# Altium project sion.PrjPcb
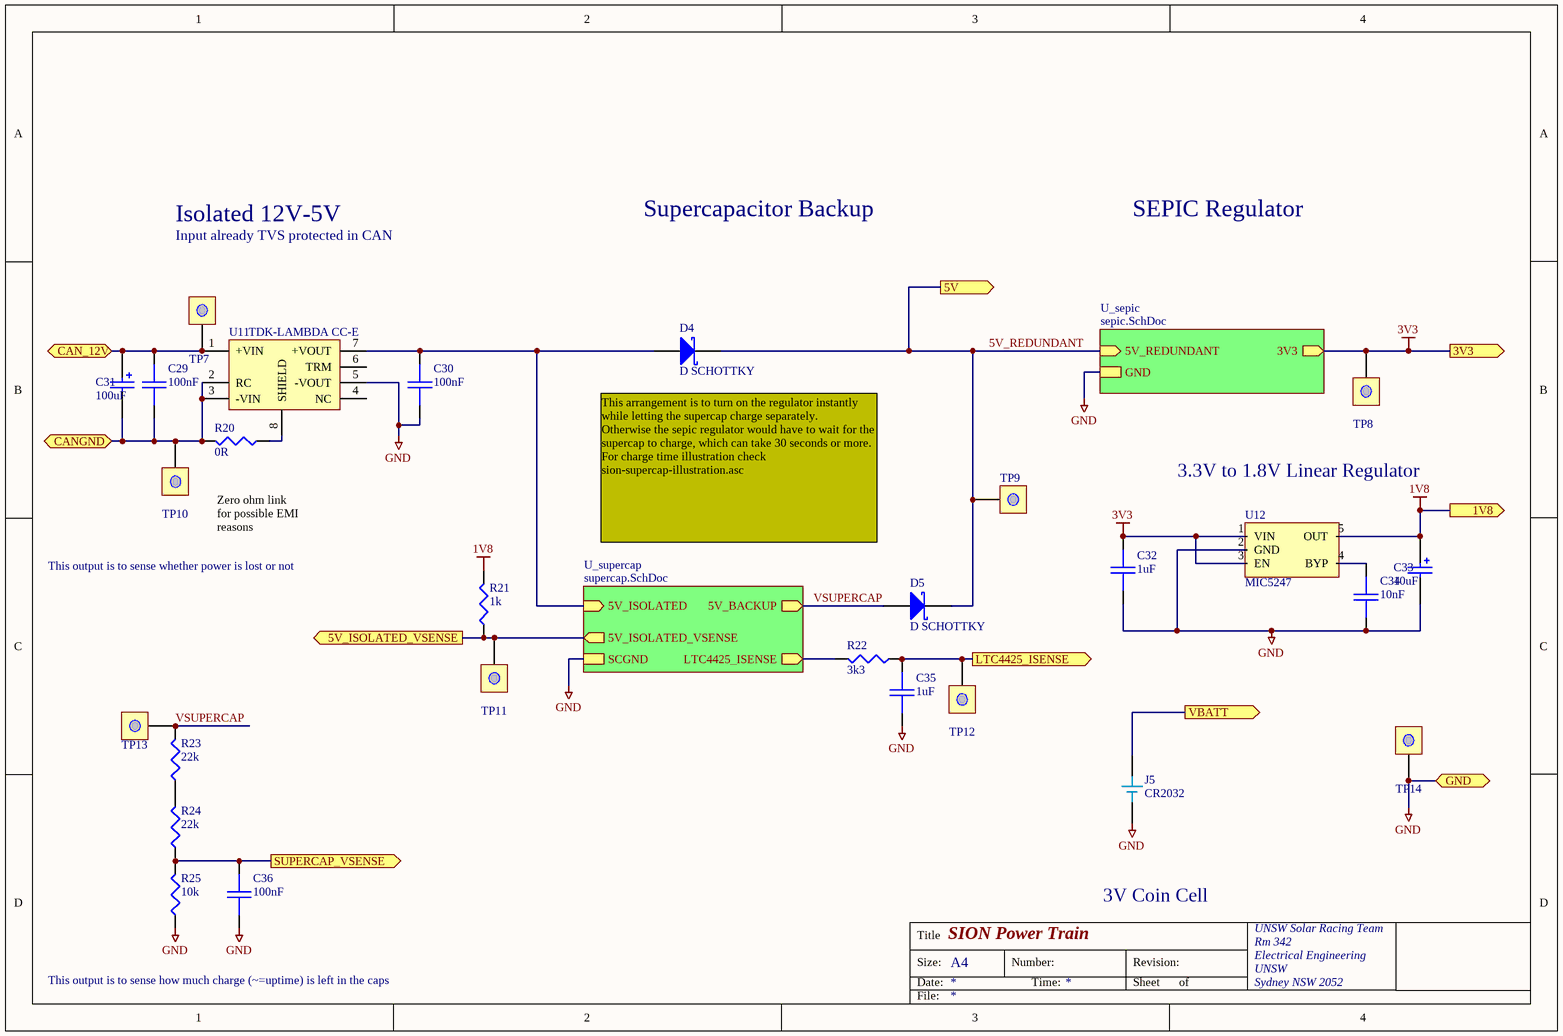
[diagram p0: powertrain.SchDoc]
4 sheets, 111 parts. Net scope: hierarchical (ports join the sheet entries above them; power ports are global).
Board file: sion_pcb_v2.PcbDoc
Sheets:
  powertrain.SchDoc
    U_supercap = supercap.SchDoc
    U_sepic = sepic.SchDoc
  LPC1768.SchDoc

## Sheet powertrain.SchDoc: SION Power Train
size A4; Organization: UNSW Solar Racing Team; Address3: UNSW; Address4: Sydney NSW 2052; Address2: Electrical Engineering; Address1: Rm 342

### Parts
C29  100nF  [0603]
C30  100nF  [0603]
C31  100uF  [MCCT-CASEA]
C32  1uF  [0805]
C33  10uF  [MCCT-CASEA]
C34  10nF  [0603]
C35  1uF  [0805]
C36  100nF  [0603]
D4  D SCHOTTKY  [DIODE-D1.5mm]
D5  D SCHOTTKY  [DIODE-D1.5mm]
J5  CR2032  [CR2032_VERTICAL]
R20  0R  [1206]
R21  1k  [0603]
R22  3k3  [0603]
R23  22k  [0805]
R24  22k  [0805]
R25  10k  [0805]
TP7  CAN12V  [TESTPOINT]  (value not drawn)
TP8  3V3  [TESTPOINT]  (value not drawn)
TP9  5V  [TESTPOINT]  (value not drawn)
TP10  CANGND  [TESTPOINT]  (value not drawn)
TP11  VSENSE  [TESTPOINT]  (value not drawn)
TP12  ISENSE  [TESTPOINT]  (value not drawn)
TP13  VCAP  [TESTPOINT]  (value not drawn)
TP14  GND  [TESTPOINT]  (value not drawn)
U11  TDK-LAMBDA CC-E  [CC10-F-E]
U12  MIC5247  [SOT23-5]

### Sub-sheets
U_sepic = sepic.SchDoc: 3V3 (out), 5V_REDUNDANT (in), GND
U_supercap = supercap.SchDoc: LTC4425_ISENSE (out), 5V_ISOLATED (in), 5V_BACKUP (out), SCGND, 5V_ISOLATED_VSENSE (out)

### Ports
1V8 (out), 3V3 (out), 5V (out), 5V_ISOLATED_VSENSE (out), CAN_12V, CANGND, GND, LTC4425_ISENSE (out), SUPERCAP_VSENSE (out), VBATT (out)

### Nets
1V8: C33.1 R21.2 U12.5(OUT) ; port 1V8
3V3: C32.1 TP8.0(TP) U12.1(VIN) U12.3(EN) ; port 3V3, sheet U_sepic/3V3  [project net VDDA]
GND: C30.2 C32.2 C33.2 C34.2 C35.2 C36.2 J5.2 R25.1 TP14.0(TP) U11.5(-VOUT) U12.2(GND) ; port GND, sheet U_supercap/SCGND, sheet U_sepic/GND  [project net VREFN]
5V_ISOLATED: C30.1 D4.A U11.7(+VOUT) ; sheet U_supercap/5V_ISOLATED
5V_REDUNDANT: D4.K D5.K TP9.0(TP) ; port 5V, sheet U_sepic/5V_REDUNDANT
~{PFO}: R21.1 TP11.0(TP) ; port 5V_ISOLATED_VSENSE, sheet U_supercap/5V_ISOLATED_VSENSE
PROG: R22.2 ; sheet U_supercap/LTC4425_ISENSE
VSUPERCAP: D5.A R23.2 TP13.0(TP) ; sheet U_supercap/5V_BACKUP
NetC29_1: C29.1 C31.1 TP7.0(TP) U11.1(+VIN) ; port CAN_12V
NetC29_2: C29.2 C31.2 R20.2 TP10.0(TP) U11.2(RC) U11.3(-VIN) ; port CANGND
NetC34_1: C34.1 U12.4(BYP)
NetC35_1: C35.1 R22.1 TP12.0(TP) ; port LTC4425_ISENSE
NetC36_1: C36.1 R24.1 R25.2 ; port SUPERCAP_VSENSE
NetJ5_1: J5.1(3V) ; port VBATT
NetR20_1: R20.1 U11.8(SHIELD)
NetR23_1: R23.1 R24.2

Not connected (* = marked no-connect by the designer): U11 4(NC) 6(TRM)

### Notes on the sheet
- Isolated 12V-5V
- Input already TVS protected in CAN
- Supercapacitor Backup
- SEPIC Regulator
- 3.3V to 1.8V Linear Regulator
- This output is to sense whether power is lost or not
- Zero ohm link
  for possible EMI reasons
- (near D4) This arrangement is to turn on the regulator instantly while letting the supercap charge separately.
  Otherwise the sepic regulator would have to wait for the supercap to charge, which can take 30 seconds or more.
  For charge time illustration check sion-supercap-illustration.asc
- 3V Coin Cell
- This output is to sense how much charge (~=uptime) is left in the caps
- Title
- Size:
- Date:
- A4
- Number:
- Time:
- Revision:
- Sheet
- of
- File:

### Library data of the parts
C29 C30 C32 C34-C36 = CAP: Capacitor
C31 C33 = CAP POL3: Polarized Capacitor (Surface Mount); Revision: July-2002: Re-released for DXP Platform.
  C31: Digikey: 495-2256-1-ND; DigikeyPrice: 1.24; Farnell: 1658601; FarnellPrice: 2.64
  C33: Digikey: 399-3687-1-ND; DigikeyPrice: 0.54; Farnell: 1650980; FarnellPrice: 0.786
D4 D5 = D SCHOTTKY: Schottky Diode; RS: 3954196; Revision: July-2002: Re-released for DXP Platform.; Digikey: 95SQ015-ND; DigikeyPrice: 3.36; Farnell: 506795; FarnellPrice: 8.61
J5 = CR2032: Battery Coin CR2032 3V; Farnell: 1216359; Farnellprice: 3.97
R20-R25 = RES1: Resistor
  R23 R24: Digikey: P22KDACT-ND; DigikeyPrice: 0.54; Farnell: 9370986; FarnellPrice: 0.04
  R25: Farnell: 1612522; FarnellPrice: 0.022; Digikey: P10.0KCCT-ND; DigikeyPrice: 0.07
TP7-TP14 = TEST: TEST POINT
U11 = CC10-F-E: Isolated DC-DC Converter; Digikey: 445-2435-ND; Farnell: 1547717; FarnellPrice: 56.78; DigikeyPrice: 26.66
U12 = MIC5247: 150mA Low-Voltage Linear Regulator; Digikey: 576-1288-1-ND; DigikeyPrice: 1.08

## Sheet supercap.SchDoc: SION Supercapacitor Charger
size A4; Organization: UNSW Solar Racing Team; Address3: UNSW; Address4: Sydney NSW 2052; Address2: Electrical Engineering; Address1: Room 342
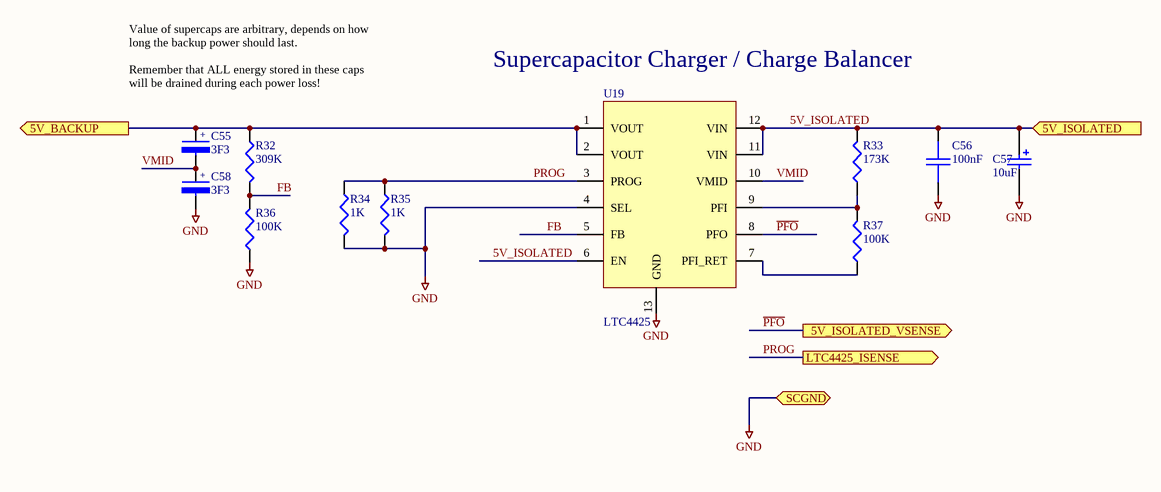
[diagram p1: supercap.SchDoc]

### Parts
C55  3F3  [ELECTROLYTIC-5-32]
C56  100nF  [0603]
C57  10uF  [MCCT-CASEA]
C58  3F3  [ELECTROLYTIC-5-32]
R32  309K  [0603]
R33  173K  [0603]
R34  1K  [0603]
R35  1K  [0603]
R36  100K  [0603]
R37  100K  [0603]
U19  LTC4425  [MS-12]

### Ports
5V_BACKUP (out), 5V_ISOLATED (in), 5V_ISOLATED_VSENSE (out), LTC4425_ISENSE (out), SCGND

### Nets
GND: C56.2 C57.2 C58.2 R34.2 R35.2 R36.1 U19.4(SEL) U19.13(GND) ; port SCGND  [project net VREFN]
5V_ISOLATED: C56.1 C57.1 R33.2 U19.6(EN) U19.11(VIN) U19.12(VIN) ; port 5V_ISOLATED
FB: R32.2 R36.2 U19.5(FB)
~{PFO}: U19.8(PFO) ; port 5V_ISOLATED_VSENSE
PROG: R34.1 R35.1 U19.3(PROG) ; port LTC4425_ISENSE
VMID: C55.2 C58.1 U19.10(VMID)
VSUPERCAP: C55.1 R32.1 U19.1(VOUT) U19.2(VOUT) ; port 5V_BACKUP
NetR33_1: R33.1 R37.2 U19.9(PFI)
NetR37_1: R37.1 U19.7(PFI_RET)

### Notes on the sheet
- Supercapacitor Charger / Charge Balancer
- Value of supercaps are arbitrary, depends on how long the backup power should last.
  Remember that ALL energy stored in these caps will be drained during each power loss!
- Title
- Size:
- Date:
- A4
- Number:
- Time:
- Revision:
- Sheet
- of
- File:
- (in symbol CAP-POL) +

### Library data of the parts
C55 C58 = CAP-POL: Supercap; Notes: Nichicon is preferred - higher voltage.; Digikey: 493-3293-ND; Farnell: 1853360; DigikeyPrice: 3.05; FarnellPrice: 4.15
C56 = CAP: Capacitor
C57 = CAP POL3: Polarized Capacitor (Surface Mount); Revision: July-2002: Re-released for DXP Platform.; Digikey: 399-3687-1-ND; DigikeyPrice: 0.54; Farnell: 1650980; FarnellPrice: 0.786
R32-R37 = RES1: Resistor
  R32: Farnell: 1797157; Digikey: P309KHCT-ND; DigikeyPrice: 0.04; FarnellPrice: 0.559
  R33: FArnell: 1151739; FarnellPrice: 0.157; Digikey: P75.0KHCT-ND; DigikeyPrice: 0.04
  R34 R35: Farnell: 9364366; Digikey: RR08P1.0KDCT-ND; DigikeyPrice: 0.148; FarnellPrice: 0.04
  R36 R37: Farnell: 1344361; FarnellPrice: 0.02; Digikey: CRT0603-BY-1003ELFCT-ND; DigikeyPrice: 0.25
U19 = LTC4425: Supercapacitor Charger; Farnell: 1839114; FarnellPrice: 12.63; Digikey: LTC4425EMSE#PBF-ND; DigikeyPrice: 5.0

## Sheet sepic.SchDoc: SION SEPIC v2 Prototype
size A4; Organization: UNSW Solar Racing Team; Address3: UNSW; Address4: Sydney NSW 2052; Address2: Electrical Engineering; Address1: Room 342
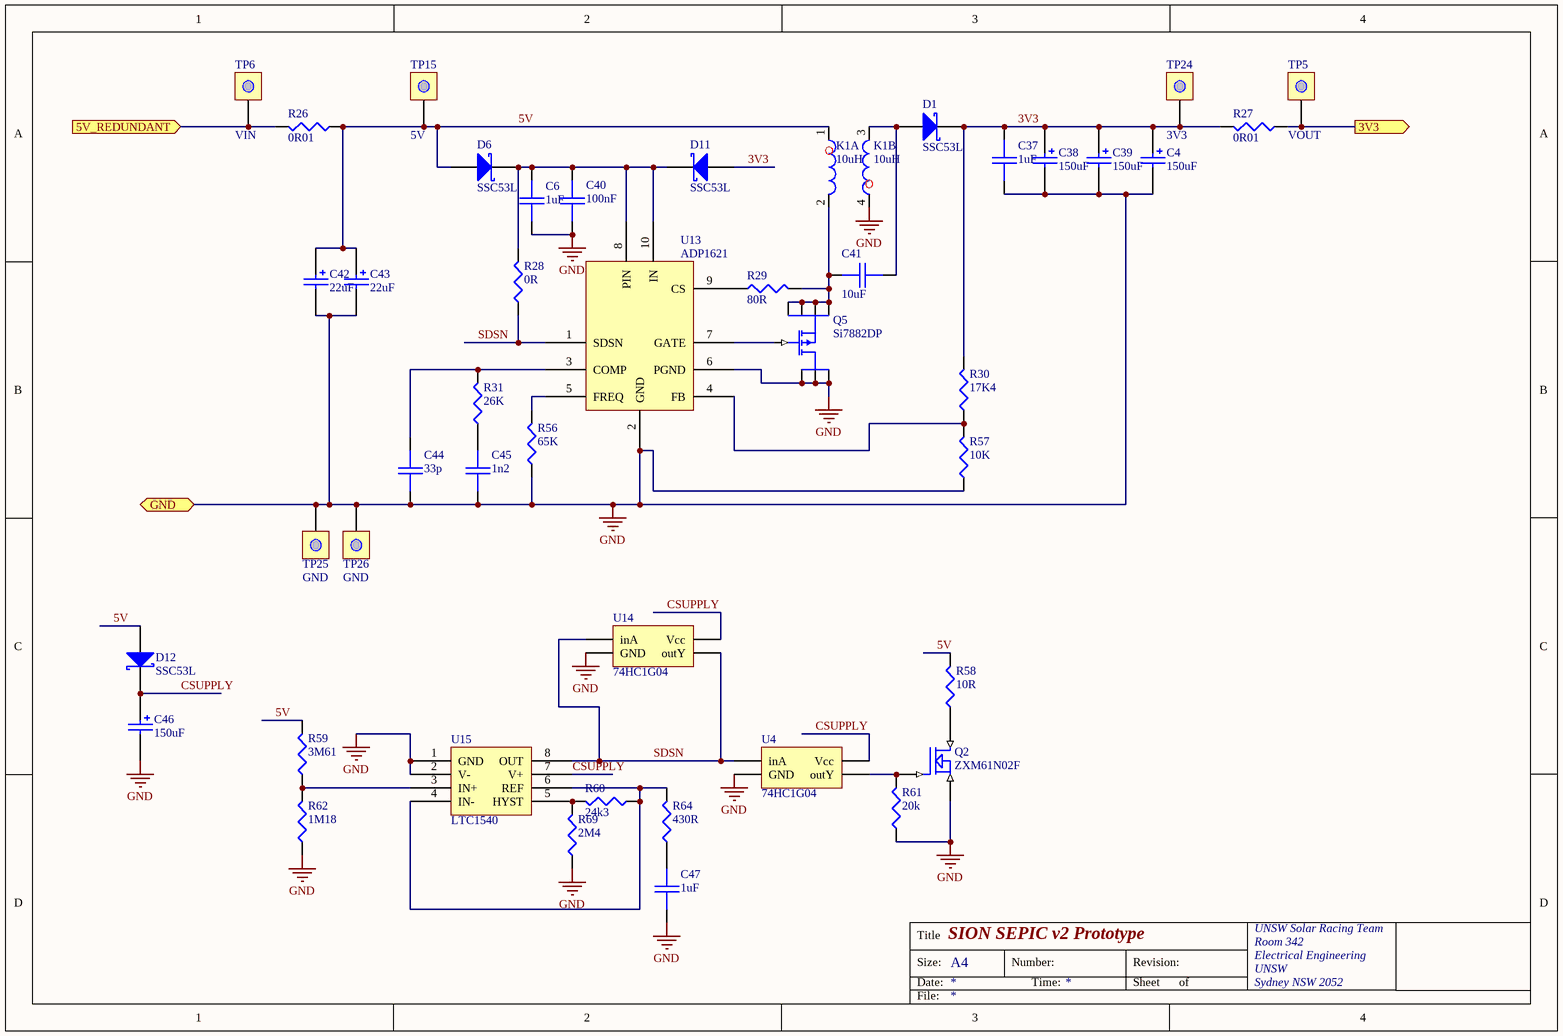
[diagram p2: sepic.SchDoc]

### Parts
C4  150uF  [MCCT-CASED]
C6  1uF  [0805]
C37  1uF  [0805]
C38  150uF  [MCCT-CASED]
C39  150uF  [MCCT-CASED]
C40  100nF  [0603]
C41  10uF  [0805]
C42  22uF  [MCCT-CASEB]
C43  22uF  [MCCT-CASEB]
C44  33p  [0603]
C45  1n2  [0603]
C46  150uF  [MCCT-CASED]
C47  1uF  [0805]
D1  SSC53L  [SMB]
D6  SSC53L  [SMB]
D11  SSC53L  [SMB]
D12  SSC53L  [SMB]
K1  10uH  [CTX2]  (parts A,B of 2)
Q2  ZXM61N02F  [SOT23-3]
Q5  Si7882DP  [SO8]
R26  0R01  [1206]
R27  0R01  [1206]
R28  0R  [0603]
R29  80R  [0603]
R30  17K4  [0603]
R31  26K  [0603]
R56  65K  [0603]
R57  10K  [0603]
R58  10R  [DIODE0.7]
R59  3M61  [0805]
R60  24k3  [0805]
R61  20k  [0805]
R62  1M18  [0805]
R64  430R  [0805]
R69  2M4  [0805]
TP5  VOUT  [TESTPOINT]
TP6  VIN  [TESTPOINT]
TP15  5V  [TESTPOINT]
TP24  3V3  [TESTPOINT]
TP25  GND  [TESTPOINT]
TP26  GND  [TESTPOINT]
U4  74HC1G04  [SOT23-5]
U13  ADP1621  [MSOP10]
U14  74HC1G04  [SOT23-5]
U15  LTC1540  [SO8]

### Ports
3V3 (out), 5V_REDUNDANT (in), GND

### Nets
GND: C4.2 C6.2 C37.2 C38.2 C39.2 C40.1 C42.2 C43.2 C44.2 C45.2 C46.2 C47.2 K1.4 Q2.2(S) Q5.1(S) Q5.2(S) Q5.3(S) R56.1 R57.1 R61.1 R62.1 R69.1 TP25.0(TP) TP26.0(TP) U4.3(GND) U13.2(GND) U13.6(PGND) U14.3(GND) U15.1(GND) U15.2(V-) ; port GND  [project net VREFN]
VDDA: R27.1 TP5.0(TP) ; port 3V3
3V3: C4.1 C37.1 C38.1 C39.1 D1.K D11.A R27.2 R30.2 TP24.0(TP)
5V: C42.1 C43.1 D6.A D12.A K1.1 R26.1 R58.2 R59.2 TP15.0(TP)
5V_REDUNDANT: R26.2 TP6.0(TP) ; port 5V_REDUNDANT
CSUPPLY: C46.1 D12.K U4.5(Vcc) U14.5(Vcc) U15.7(V+)
SDSN: R28.1 U4.2(inA) U13.1(SDSN) U14.2(inA) U14.4(outY) U15.8(OUT)
NetC6_1: C6.1 C40.2 D6.K D11.K R28.2 U13.8(PIN) U13.10(IN)
NetC41_1: C41.1 K1.2 Q5.5(D) Q5.6(D) Q5.7(D) Q5.8(D) R29.2
NetC41_2: C41.2 D1.A K1.3
NetC44_1: C44.1 R31.2 U13.3(COMP)
NetC45_1: C45.1 R31.1
NetC47_1: C47.1 R64.1
NetQ2_1: Q2.1(G) R61.2 U4.4(outY)
NetQ2_3: Q2.3(D) R58.1
NetQ5_4: Q5.4(G) U13.7(GATE)
NetR29_1: R29.1 U13.9(CS)
NetR30_1: R30.1 R57.2 U13.4(FB)
NetR56_2: R56.2 U13.5(FREQ)
NetR59_1: R59.1 R62.2 U15.3(IN+)
NetR60_1: R60.1 R64.2 U15.4(IN-) U15.6(REF)
NetR60_2: R60.2 R69.2 U15.5(HYST)

### Notes on the sheet
- Title
- Size:
- Date:
- A4
- Number:
- Time:
- Revision:
- Sheet
- of
- File:

### Library data of the parts
C4 C38 C39 C42 C43 C46 = CAP POL3: Polarized Capacitor (Surface Mount); Manufacturer: Generic Components; Class I: Passive; Value: 100pF; Published: 8-Jun-2000; Revision: July-2002: Re-released for DXP Platform.; Publisher: Altium Limited; Class II: Capacitor
  C4 C38 C39 C46: Farnell: 1754096; FarnellPrice: 2.97
  C42 C43: Farnell: 1457447; FarnellPrice: 1.06
C6 C37 C40 C44 C45 C47 = CAP: Capacitor
  C6 C37 C47: Farnell: 1683651; FarnellPrice: 0.05
  C44: Farnell: 1816801; FarnellPrice: 0.05
  C45: Farnell: 3019664; FarnellPrice: 0.167
C41 = CAP: grm21br61a106k; Farnell: 1828805; FarnellPrice: 0.448
D1 D6 D11 D12 = D SCHOTTKY: Schottky Diode; Manufacturer: Generic Components; Class I: Discrete; Class II: Diode - Schottky; Published: 8-Jun-2000; Revision: July-2002: Re-released for DXP Platform.; Publisher: Altium Limited; Farnell: 1336558; FarnellPrice: 2.64
K1 = CTX10-2-R: Coupled Power Inductor; Farnell: 1194198; Price: 8.53
Q2 = ZXM61N02F: 1.7A, 20V N-Channel Enhancement mode FET
Q5 = Si7882DP: Power N mosfet; Farnell: 1470159; FarnellPrice: 5.15
R26-R31 R56-R62 R64 R69 = RES1: Resistor
  R26 R27: Farnell: 8067520; FarnellPrice: 0.616
  R29: Farnell: 1644187; FarnellPrice: 0.075
  R30: Farnell: 1152720; FarnellPrice: 0.02
  R31: Farnell: 1152861; FarnellPrice: 0.02
  R56: Farnell: 1633712; FarnellPrice: 0.01
  R57: Farnell: 1469669; FarnellPrice: 0.02
  R58: Farnell: 1357872; FarnellPrice: 0.119
  R59: Farnell: 1811688; FarnellPrice: 0.044
  R60: Farnell: 1151849; FarnellPrice: 0.125
  R61: Source: Stock / Pulldown resistor
  R62: Farnell: 1570707; FarnellPrice: 0.125
  R64: Farnell: 1260827; FarnellPrice: 0.02
  R69: Farnell: 1811652; FarnellPrice: 0.044
TP5 TP6 TP15 TP24-TP26 = TEST: TEST POINT
U4 U14 = 74HC1G04: Single gate inverter; Farnell: 1085251; FarnellPrice: 1.08
U13 = ADP1621: SEPIC / Boost Controller; Digikey: ADP1621ARMZ-R7CT-ND; DigikeyPrice: 2.97; Farnell: 1461500; FarnellPrice: 5.27
U15 = LTC1540: Comparator with Reference & Hysterisis; Farnell: 1663644; FarnellPrice: 5.62; Digikey: LTC1540IS8#PBF-ND; DigikeyPrice: 3.5

## Sheet LPC1768.SchDoc: LPC1768
size A4; Organization: UNSW Solar Racing Team; Address3: UNSW; Address4: Sydney NSW 2052; Address2: Electrical Engineering; Address1: Room 342
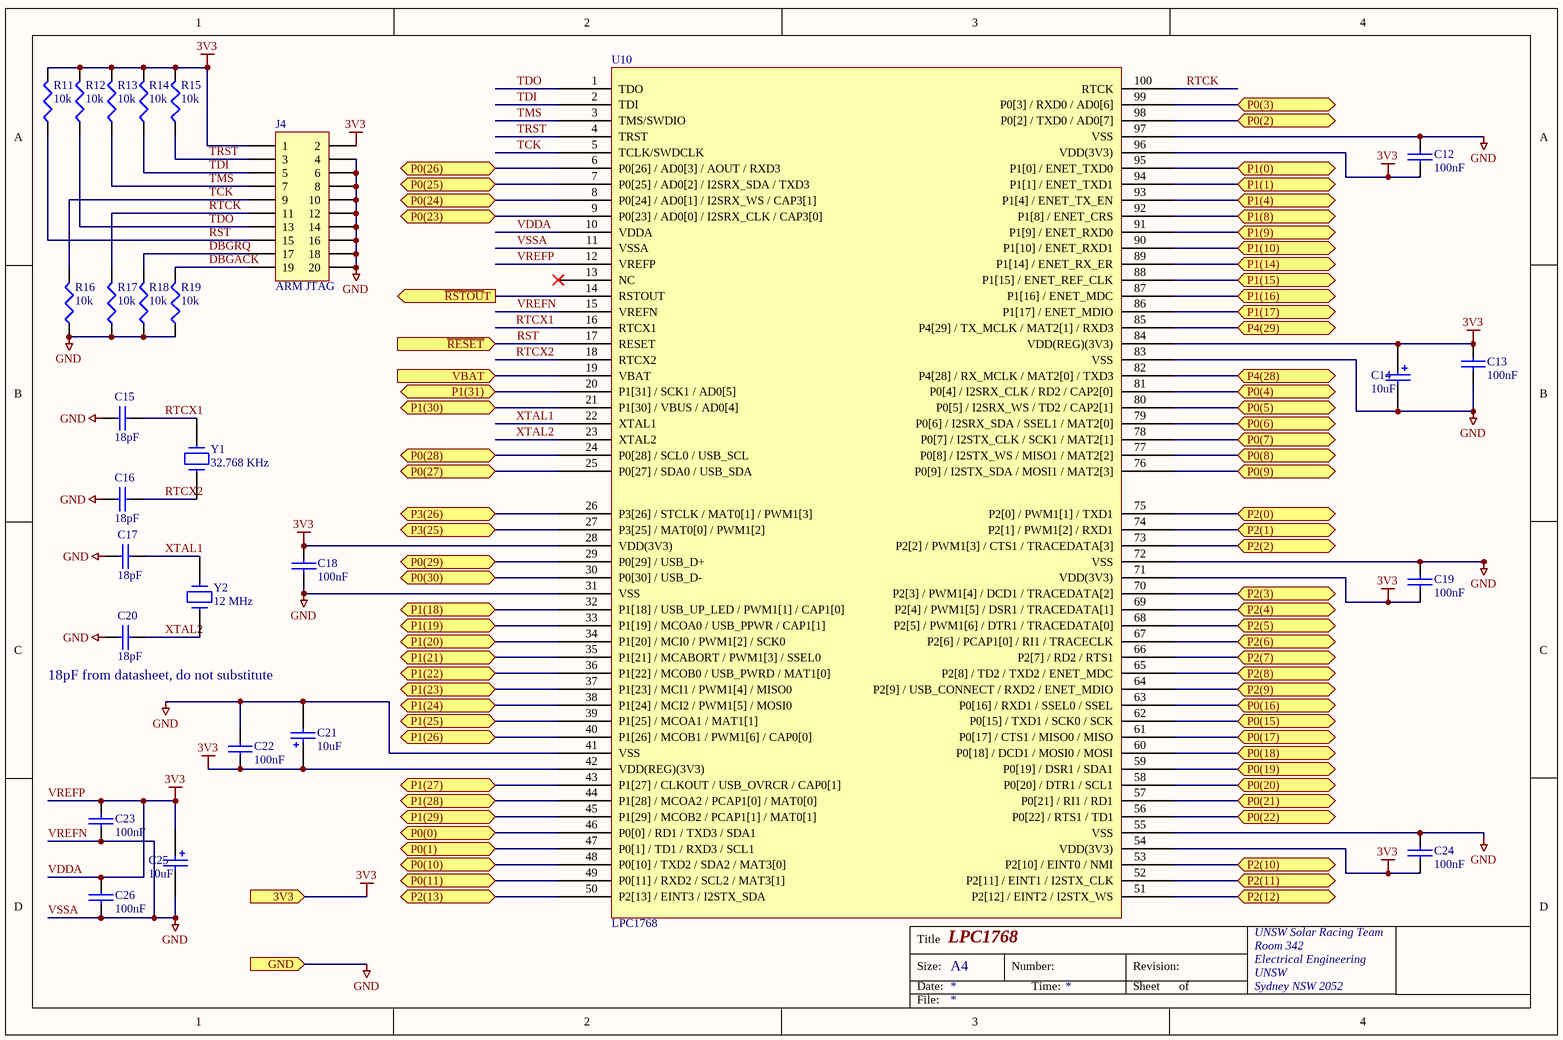
[diagram p3: LPC1768.SchDoc]

### Parts
C12  100nF  [0603]
C13  100nF  [0603]
C14  10uF  [MCCT-CASEA]
C15  18pF  [0603]
C16  18pF  [0603]
C17  18pF  [0603]
C18  100nF  [0603]
C19  100nF  [0603]
C20  18pF  [0603]
C21  10uF  [MCCT-CASEA]
C22  100nF  [0603]
C23  100nF  [0603]
C24  100nF  [0603]
C25  10uF  [MCCT-CASEA]
C26  100nF  [0603]
J4  ARM JTAG  [HDR2X10]
R11  10k  [0603]
R12  10k  [0603]
R13  10k  [0603]
R14  10k  [0603]
R15  10k  [0603]
R16  10k  [0603]
R17  10k  [0603]
R18  10k  [0603]
R19  10k  [0603]
U10  LPC1768  [QFP100]
Y1  32.768 KHz  [WATCHA]
Y2  12 MHz  [HC49/4H]

### Ports
3V3, GND, P0(0), P0(1), P0(2), P0(3), P0(4), P0(5), P0(6), P0(7), P0(8), P0(9), P0(10), P0(11), P0(15), P0(16), P0(17), P0(18), P0(19), P0(20), P0(21), P0(22), P0(23), P0(24), P0(25), P0(26), P0(27), P0(28), P0(29), P0(30), P1(0), P1(1), P1(4), P1(8), P1(9), P1(10), P1(14), P1(15), P1(16), P1(17), P1(18), P1(19), P1(20), P1(21), P1(22), P1(23), P1(24), P1(25), P1(26), P1(27), P1(28), P1(29), P1(30), P1(31), P2(0), P2(1), P2(2), P2(3), P2(4), P2(5), P2(6), P2(7), P2(8), P2(9), P2(10), P2(11), P2(12), P2(13), P3(25), P3(26), P4(28), P4(29), VBAT (in), ~{RESET} (in), ~{RSTOU}T (out)

### Nets
VDDA: C12.2 C13.1 C14.1 C18.1 C19.2 C21.1 C22.2 C23.1 C24.2 C25.1 C26.1 J4.1 J4.2 R11.2 R12.2 R13.2 R14.2 R15.2 U10.10(VDDA) U10.12(VREFP) U10.28(VDD(3V3)) U10.42(VDD(REG)(3V3)) U10.54(VDD(3V3)) U10.71(VDD(3V3)) U10.84(VDD(REG)(3V3)) U10.96(VDD(3V3)) ; port 3V3  [also labelled 3V3, VREFP]
VREFN: C12.1 C13.2 C14.2 C15.2 C16.2 C17.2 C18.2 C19.1 C20.2 C21.2 C22.1 C23.2 C24.1 C25.2 C26.2 J4.4 J4.6 J4.8 J4.10 J4.12 J4.14 J4.16 J4.18 J4.20 R16.1 R17.1 R18.1 R19.1 U10.11(VSSA) U10.15(VREFN) U10.31(VSS) U10.41(VSS) U10.55(VSS) U10.72(VSS) U10.83(VSS) U10.97(VSS) ; port GND  [also labelled GND, VSSA]
DBGACK: J4.19 R19.2
DBGRQ: J4.17 R18.2
RST: J4.15 R11.1 U10.17(RESET) ; port ~{RESET}
RTCK: J4.11 R17.2 U10.100(RTCK)
RTCX1: C15.1 U10.16(RTCX1) Y1.2
RTCX2: C16.1 U10.18(RTCX2) Y1.1
TCK: J4.9 R16.2 U10.5(TCLK/SWDCLK)
TDI: J4.5 R14.1 U10.2(TDI)
TDO: J4.13 R12.1 U10.1(TDO)
TMS: J4.7 R13.1 U10.3(TMS/SWDIO)
TRST: J4.3 R15.1 U10.4(TRST)
XTAL1: C17.1 U10.22(XTAL1) Y2.1
XTAL2: C20.1 U10.23(XTAL2) Y2.2
NetU10_6: U10.6(P0[26]_/_AD0[3]_/_AOUT_/_RXD3) ; port P0(26)
NetU10_7: U10.7(P0[25]_/_AD0[2]_/_I2SRX_SDA_/_TXD3) ; port P0(25)
NetU10_8: U10.8(P0[24]_/_AD0[1]_/_I2SRX_WS_/_CAP3[1]) ; port P0(24)
NetU10_9: U10.9(P0[23]_/_AD0[0]_/_I2SRX_CLK_/_CAP3[0]) ; port P0(23)
NetU10_14: U10.14(RSTOUT) ; port ~{RSTOU}T
NetU10_19: U10.19(VBAT) ; port VBAT
NetU10_20: U10.20(P1[31]_/_SCK1_/_AD0[5]) ; port P1(31)
NetU10_21: U10.21(P1[30]_/_VBUS_/_AD0[4]) ; port P1(30)
NetU10_24: U10.24(P0[28]_/_SCL0_/_USB_SCL) ; port P0(28)
NetU10_25: U10.25(P0[27]_/_SDA0_/_USB_SDA) ; port P0(27)
NetU10_26: U10.26(P3[26]_/_STCLK_/_MAT0[1]_/_PWM1[3]) ; port P3(26)
NetU10_27: U10.27(P3[25]_/_MAT0[0]_/_PWM1[2]) ; port P3(25)
NetU10_29: U10.29(P0[29]_/_USB_D+) ; port P0(29)
NetU10_30: U10.30(P0[30]_/_USB_D-) ; port P0(30)
NetU10_32: U10.32(P1[18]_/_USB_UP_LED_/_PWM1[1]_/_CAP1[0]) ; port P1(18)
NetU10_33: U10.33(P1[19]_/_MCOA0_/_USB_PPWR_/_CAP1[1]) ; port P1(19)
NetU10_34: U10.34(P1[20]_/_MCI0_/_PWM1[2]_/_SCK0) ; port P1(20)
NetU10_35: U10.35(P1[21]_/_MCABORT_/_PWM1[3]_/_SSEL0) ; port P1(21)
NetU10_36: U10.36(P1[22]_/_MCOB0_/_USB_PWRD_/_MAT1[0]) ; port P1(22)
NetU10_37: U10.37(P1[23]_/_MCI1_/_PWM1[4]_/_MISO0) ; port P1(23)
NetU10_38: U10.38(P1[24]_/_MCI2_/_PWM1[5]_/_MOSI0) ; port P1(24)
NetU10_39: U10.39(P1[25]_/_MCOA1_/_MAT1[1]) ; port P1(25)
NetU10_40: U10.40(P1[26]_/_MCOB1_/_PWM1[6]_/_CAP0[0]) ; port P1(26)
NetU10_43: U10.43(P1[27]_/_CLKOUT_/_USB_OVRCR_/_CAP0[1]) ; port P1(27)
NetU10_44: U10.44(P1[28]_/_MCOA2_/_PCAP1[0]_/_MAT0[0]) ; port P1(28)
NetU10_45: U10.45(P1[29]_/_MCOB2_/_PCAP1[1]_/_MAT0[1]) ; port P1(29)
NetU10_46: U10.46(P0[0]_/_RD1_/_TXD3_/_SDA1) ; port P0(0)
NetU10_47: U10.47(P0[1]_/_TD1_/_RXD3_/_SCL1) ; port P0(1)
NetU10_48: U10.48(P0[10]_/_TXD2_/_SDA2_/_MAT3[0]) ; port P0(10)
NetU10_49: U10.49(P0[11]_/_RXD2_/_SCL2_/_MAT3[1]) ; port P0(11)
NetU10_50: U10.50(P2[13]_/_EINT3_/_I2STX_SDA) ; port P2(13)
NetU10_51: U10.51(P2[12]_/_EINT2_/_I2STX_WS) ; port P2(12)
NetU10_52: U10.52(P2[11]_/_EINT1_/_I2STX_CLK) ; port P2(11)
NetU10_53: U10.53(P2[10]_/_EINT0_/_NMI) ; port P2(10)
NetU10_56: U10.56(P0[22]_/_RTS1_/_TD1) ; port P0(22)
NetU10_57: U10.57(P0[21]_/_RI1_/_RD1) ; port P0(21)
NetU10_58: U10.58(P0[20]_/_DTR1_/_SCL1) ; port P0(20)
NetU10_59: U10.59(P0[19]_/_DSR1_/_SDA1) ; port P0(19)
NetU10_60: U10.60(P0[18]_/_DCD1_/_MOSI0_/_MOSI) ; port P0(18)
NetU10_61: U10.61(P0[17]_/_CTS1_/_MISO0_/_MISO) ; port P0(17)
NetU10_62: U10.62(P0[15]_/_TXD1_/_SCK0_/_SCK) ; port P0(15)
NetU10_63: U10.63(P0[16]_/_RXD1_/_SSEL0_/_SSEL) ; port P0(16)
NetU10_64: U10.64(P2[9]_/_USB_CONNECT_/_RXD2_/_ENET_MDIO) ; port P2(9)
NetU10_65: U10.65(P2[8]_/_TD2_/_TXD2_/_ENET_MDC) ; port P2(8)
NetU10_66: U10.66(P2[7]_/_RD2_/_RTS1) ; port P2(7)
NetU10_67: U10.67(P2[6]_/_PCAP1[0]_/_RI1_/_TRACECLK) ; port P2(6)
NetU10_68: U10.68(P2[5]_/_PWM1[6]_/_DTR1_/_TRACEDATA[0]) ; port P2(5)
NetU10_69: U10.69(P2[4]_/_PWM1[5]_/_DSR1_/_TRACEDATA[1]) ; port P2(4)
NetU10_70: U10.70(P2[3]_/_PWM1[4]_/_DCD1_/_TRACEDATA[2]) ; port P2(3)
NetU10_73: U10.73(P2[2]_/_PWM1[3]_/_CTS1_/_TRACEDATA[3]) ; port P2(2)
NetU10_74: U10.74(P2[1]_/_PWM1[2]_/_RXD1) ; port P2(1)
NetU10_75: U10.75(P2[0]_/_PWM1[1]_/_TXD1) ; port P2(0)
NetU10_76: U10.76(P0[9]_/_I2STX_SDA_/_MOSI1_/_MAT2[3]) ; port P0(9)
NetU10_77: U10.77(P0[8]_/_I2STX_WS_/_MISO1_/_MAT2[2]) ; port P0(8)
NetU10_78: U10.78(P0[7]_/_I2STX_CLK_/_SCK1_/_MAT2[1]) ; port P0(7)
NetU10_79: U10.79(P0[6]_/_I2SRX_SDA_/_SSEL1_/_MAT2[0]) ; port P0(6)
NetU10_80: U10.80(P0[5]_/_I2SRX_WS_/_TD2_/_CAP2[1]) ; port P0(5)
NetU10_81: U10.81(P0[4]_/_I2SRX_CLK_/_RD2_/_CAP2[0]) ; port P0(4)
NetU10_82: U10.82(P4[28]_/_RX_MCLK_/_MAT2[0]_/_TXD3) ; port P4(28)
NetU10_85: U10.85(P4[29]_/_TX_MCLK_/_MAT2[1]_/_RXD3) ; port P4(29)
NetU10_86: U10.86(P1[17]_/_ENET_MDIO) ; port P1(17)
NetU10_87: U10.87(P1[16]_/_ENET_MDC) ; port P1(16)
NetU10_88: U10.88(P1[15]_/_ENET_REF_CLK) ; port P1(15)
NetU10_89: U10.89(P1[14]_/_ENET_RX_ER) ; port P1(14)
NetU10_90: U10.90(P1[10]_/_ENET_RXD1) ; port P1(10)
NetU10_91: U10.91(P1[9]_/_ENET_RXD0) ; port P1(9)
NetU10_92: U10.92(P1[8]_/_ENET_CRS) ; port P1(8)
NetU10_93: U10.93(P1[4]_/_ENET_TX_EN) ; port P1(4)
NetU10_94: U10.94(P1[1]_/_ENET_TXD1) ; port P1(1)
NetU10_95: U10.95(P1[0]_/_ENET_TXD0) ; port P1(0)
NetU10_98: U10.98(P0[2]_/_TXD0_/_AD0[7]) ; port P0(2)
NetU10_99: U10.99(P0[3]_/_RXD0_/_AD0[6]) ; port P0(3)

Not connected (* = marked no-connect by the designer): U10 13(NC)*

### Notes on the sheet
- 18pF from datasheet, do not substitute
- Title
- Size:
- Date:
- A4
- Number:
- Time:
- Revision:
- Sheet
- of
- File:

### Library data of the parts
C12 C13 C18 C19 C22-C24 C26 = CAP: Capacitor; Farnell: 753-567; Price: 0.30
C14 C21 C25 = CAP POL3: Polarized Capacitor (Surface Mount); Revision: July-2002: Re-released for DXP Platform.; Digikey: 399-3687-1-ND; DigikeyPrice: 0.54; Farnell: 1650980; FarnellPrice: 0.786
C15-C17 C20 = CAP: Capacitor; Order#: 721-992; Price: 0.11; Supplier: Farnell
J4 = Header 10X2: Header, 10-Pin, Dual row; Farnell: 9733647; FarnellPrice: 3.38; Digikey: WM8146-ND; DigikeyPrice: 3.39
R11-R19 = RES1: Resistor
U10 = LPC1768: NXP Cortex-M3 Microcontroller, 100pin 100MHz; Farnell: 1718549; FarnellPrice: 18.94; Digikey: 568-4796-ND; DigikeyPrice: 11.44
Y1 Y2 = CRYSTAL
  Y1: Farnell: 1611828; FarnellPrice: 0.401; Digikey: 535-9032-ND; DigikeyPrice: 0.25
  Y2: Farnell: 7940142; FarnellPrice: 0.854; DigikeyPrice: 0.46; Digikey: 887-1013-ND

## Nets that join several sheets
VDDA: powertrain (C32.1 TP8.0 U12.1 U12.3), sepic (R27.1 TP5.0), LPC1768 (26 pins)
VREFN: powertrain (11 pins), supercap (8 pins), sepic (30 pins), LPC1768 (36 pins)
5V_ISOLATED: powertrain (C30.1 D4.A U11.7), supercap (6 pins)
5V_REDUNDANT: powertrain (D4.K D5.K TP9.0), sepic (R26.2 TP6.0)
~{PFO}: powertrain (R21.1 TP11.0), supercap (U19.8)
PROG: powertrain (R22.2), supercap (R34.1 R35.1 U19.3)
VSUPERCAP: powertrain (D5.A R23.2 TP13.0), supercap (C55.1 R32.1 U19.1 U19.2)